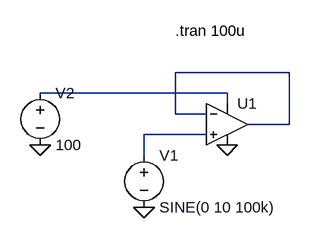
[diagram p0: schematic rectifier.asc]
rectifier.asc, the LTspice schematic file:
Version 4
SHEET 1 880 680
WIRE 608 112 432 112
WIRE 512 144 224 144
WIRE 512 160 512 144
WIRE 432 176 432 112
WIRE 480 176 432 176
WIRE 608 192 608 112
WIRE 608 192 544 192
WIRE 480 208 384 208
WIRE 384 240 384 208
FLAG 384 320 0
FLAG 512 224 0
FLAG 224 224 0
SYMBOL UniversalOpamp2 512 192 R0
SYMATTR InstName U1
SYMBOL voltage 384 224 R0
SYMATTR InstName V1
SYMATTR Value SINE(0 10 100k)
SYMBOL voltage 224 128 R0
SYMATTR InstName V2
SYMATTR Value 100
TEXT 432 48 Left 2 !.tran 100u

The netlist it stands for:
* rectifier.asc
XU1 N003 N001 N002 0 N001 level.2 Avol=1Meg GBW=10Meg Slew=10Meg ilimit=25m rail=0 Vos=0 phimargin=45 en=0 enk=0 in=0 ink=0 Rin=500Meg  ; pins IN+ IN- V+ V- OUT
V1 N003 0 SINE(0 10 100k)
V2 N002 0 100
.tran 100u
.lib UniversalOpamps2.sub
.backanno
.end